# EAGLE schematic Gloves Flex PCB (EAGLE 6.4)
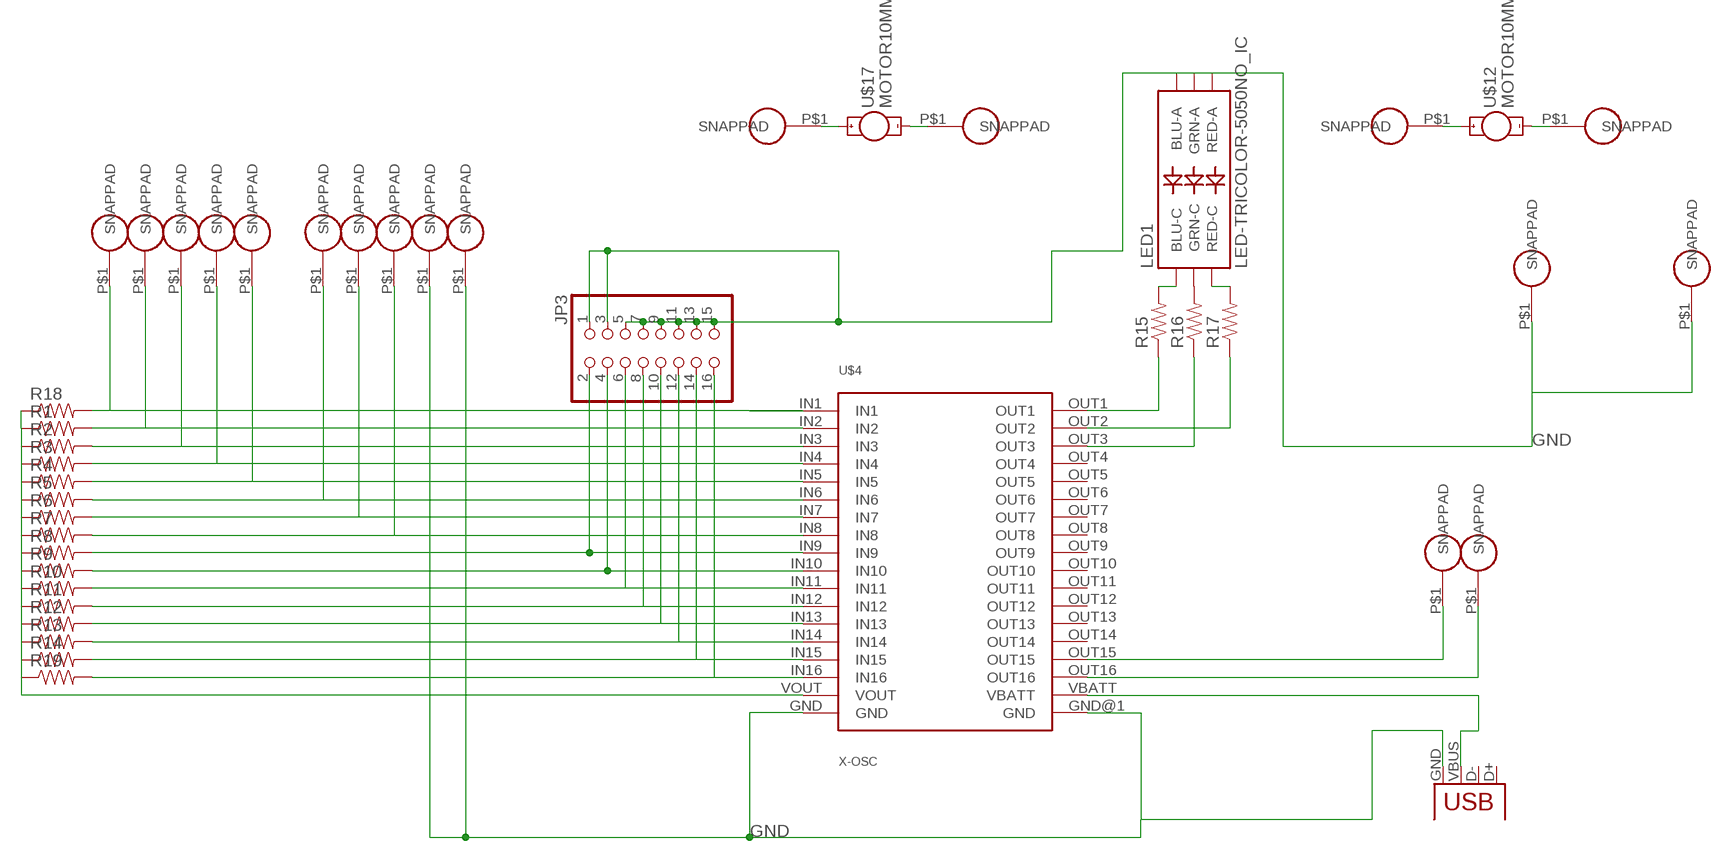
[diagram p0: schematic, sheet 1]

## Parts
JP3  PINHD-2X8  [2X08]
LED1  LED-TRICOLOR-5050NO_IC  [LED-TRICOLOR-5050]
R1  RESISTOR0805-RES  [0805]
R2  RESISTOR0805-RES  [0805]
R3  RESISTOR0805-RES  [0805]
R4  RESISTOR0805-RES  [0805]
R5  RESISTOR0805-RES  [0805]
R6  RESISTOR0805-RES  [0805]
R7  RESISTOR0805-RES  [0805]
R8  RESISTOR0805-RES  [0805]
R9  RESISTOR0805-RES  [0805]
R10  RESISTOR0805-RES  [0805]
R11  RESISTOR0805-RES  [0805]
R12  RESISTOR0805-RES  [0805]
R13  RESISTOR0805-RES  [0805]
R14  RESISTOR0805-RES  [0805]
R15  RESISTOR0805-RES  [0805]
R16  RESISTOR0805-RES  [0805]
R17  RESISTOR0805-RES  [0805]
R18  RESISTOR0805-RES  [0805]
R19  RESISTOR0805-RES  [0805]
U$1  SNAP-PAD_7MM_ROUND  [SNAP-PAD_7MM_RD]
U$2  SNAP-PAD_7MM_ROUND  [SNAP-PAD_7MM_RD]
U$3  SNAP-PAD_7MM_ROUND  [SNAP-PAD_7MM_RD]
U$4  X-OSC  [X-OSC_SMD]
U$6  SNAP-PAD_7MM_ROUND  [SNAP-PAD_7MM_RD]
U$7  SNAP-PAD_7MM_ROUND  [SNAP-PAD_7MM_RD]
U$8  SNAP-PAD_7MM_ROUND  [SNAP-PAD_7MM_RD]
U$9  SNAP-PAD_7MM_ROUND  [SNAP-PAD_7MM_RD]
U$10  SNAP-PAD_7MM_ROUND  [SNAP-PAD_7MM_RD]
U$11  SNAP-PAD_7MM_ROUND  [SNAP-PAD_7MM_RD]
U$12  MOTOR10MM  [VIBE-MOTOR-10MM]
U$13  SNAP-PAD_7MM_ROUND  [SNAP-PAD_7MM_RD]
U$14  SNAP-PAD_7MM_ROUND  [SNAP-PAD_7MM_RD]
U$15  SNAP-PAD_7MM_ROUND  [SNAP-PAD_7MM_RD]
U$17  MOTOR10MM  [VIBE-MOTOR-10MM]
U$18  SNAP-PAD_7MM_ROUND  [SNAP-PAD_7MM_RD]
U$19  SNAP-PAD_7MM_ROUND  [SNAP-PAD_7MM_RD]
U$20  SNAP-PAD_7MM_ROUND  [SNAP-PAD_7MM_RD]
U$21  SNAP-PAD_7MM_ROUND  [SNAP-PAD_7MM_RD]
U$22  SNAP-PAD_7MM_ROUND  [SNAP-PAD_7MM_RD]
U$23  SNAP-PAD_7MM_ROUND  [SNAP-PAD_7MM_RD]
X1  USB-MICROB  [USB-MICROB]

## Nets
GND: JP3.1 JP3.3 JP3.5 JP3.7 JP3.9 JP3.11 JP3.13 JP3.15 LED1.1(GRN-A) LED1.2(RED-A) LED1.3(BLU-A) U$4.GND U$4.GND@1(GND) U$10.P$1(SNAPPAD) U$11.P$1(SNAPPAD) U$15.P$1(SNAPPAD) U$18.P$1(SNAPPAD) X1.GND
N$1: LED1.6(GRN-C) R16.2
N$2: LED1.4(BLU-C) R15.2
N$3: R16.1 U$4.OUT3
N$4: R1.2 U$1.P$1(SNAPPAD) U$4.IN2
N$6: R2.2 U$2.P$1(SNAPPAD) U$4.IN3
N$7: R3.2 U$3.P$1(SNAPPAD) U$4.IN4
N$8: R4.2 U$4.IN5 U$6.P$1(SNAPPAD)
N$9: R5.2 U$4.IN6 U$7.P$1(SNAPPAD)
N$12: R6.2 U$4.IN7 U$8.P$1(SNAPPAD)
N$13: R7.2 U$4.IN8 U$9.P$1(SNAPPAD)
N$14: JP3.2 R8.2 U$4.IN9
N$15: JP3.4 R9.2 U$4.IN10
N$16: JP3.6 R10.2 U$4.IN11
N$17: LED1.5(RED-C) R17.2
N$18: JP3.8 R11.2 U$4.IN12
N$19: JP3.10 R12.2 U$4.IN13
N$20: JP3.12 R13.2 U$4.IN14
N$21: JP3.14 R14.2 U$4.IN15
N$22: JP3.16 R19.2 U$4.IN16
N$23: U$4.OUT15 U$13.P$1(SNAPPAD)
N$24: U$4.OUT16 U$14.P$1(SNAPPAD)
N$25: R17.1 U$4.OUT2
N$26: R15.1 U$4.OUT1
N$29: U$12.+ U$22.P$1(SNAPPAD)
N$30: U$12.- U$23.P$1(SNAPPAD)
N$33: U$4.VBATT X1.VBUS
N$38: U$17.+ U$19.P$1(SNAPPAD)
N$40: R18.2 U$4.IN1 U$21.P$1(SNAPPAD)
N$46: U$17.- U$20.P$1(SNAPPAD)
N$58: R1.1 R2.1 R3.1 R4.1 R5.1 R6.1 R7.1 R8.1 R9.1 R10.1 R11.1 R12.1 R13.1 R14.1 R18.1 R19.1 U$4.VOUT
Unconnected: U$4.OUT4 U$4.OUT5 U$4.OUT6 U$4.OUT7 U$4.OUT8 U$4.OUT9 U$4.OUT10 U$4.OUT11 U$4.OUT12 U$4.OUT13 U$4.OUT14 X1.D+ X1.D-

## Library data of the parts
JP3 = pinhead:PINHD-2X8: PIN HEADER
LED1 = SparkFun-LED:LED-TRICOLOR-5050
R1-R19 = SparkFun-Passives:RESISTOR: Resistor Basic schematic elements and footprints for 0603, 1206, and PTH resistors.
U$1-U$3 U$6-U$11 U$13-U$15 U$18-U$23 = hannahsEagleLib:SNAP-PAD_7MM_ROUND
U$4 = x-io:X-OSC: 2x "TSM-118-04-F-SV" See: http://www.toby.co.uk/content/catalogue/products.aspx?series=TSM-1xx-xx-SV
U$12 U$17 = SparkFun-Electromechanical:MOTOR: Vibration Motor- ROB-08449 Physical dimension and wire connections for this powerful vibration motor. Motor has a self adhesive backing.
X1 = SparkFun:USB: USB Connectors USB-B-PTH is fully proven SKU : PRT-00139 USB-miniB is fully proven SKU : PRT-00587 USB-A-PCB is untested. USB-A-H is throughly reviewed, but untested. Spark Fun Electronics SKU : PRT-00437 USB-B-SMT is throughly reviewed, but untested. Needs silkscreen touching up. USB-A-S has not been used/tested USB-MB-H has not been used/tested